# Altium schematic sheet 1A18J3_1A19J1 A.SchDoc: Cable Assembly
size A; Date: 1/1/17; CompanyName: National Center for Atmospheric Research; DrawnBy: Rich Erickson; Engineer: 4/21/17; Organization: Earth Observing Laboratory; Address1: 3450 Mitchell Lane; Address2: FL1; Address3: 3090 Center Green Dr.; Address4: Boulder, CO. 80301; DocumentNumber: 1A18J3_1A19J1(AC PWR, 120V); Revision: A; SheetNumber: 1; SheetTotal: 1; Department: Remote Sensing Facility; ModifiedDate: 7/17/97; ImagePath: 4/21/17; ProjectName: Ka Band; Application_BuildNumber: 5
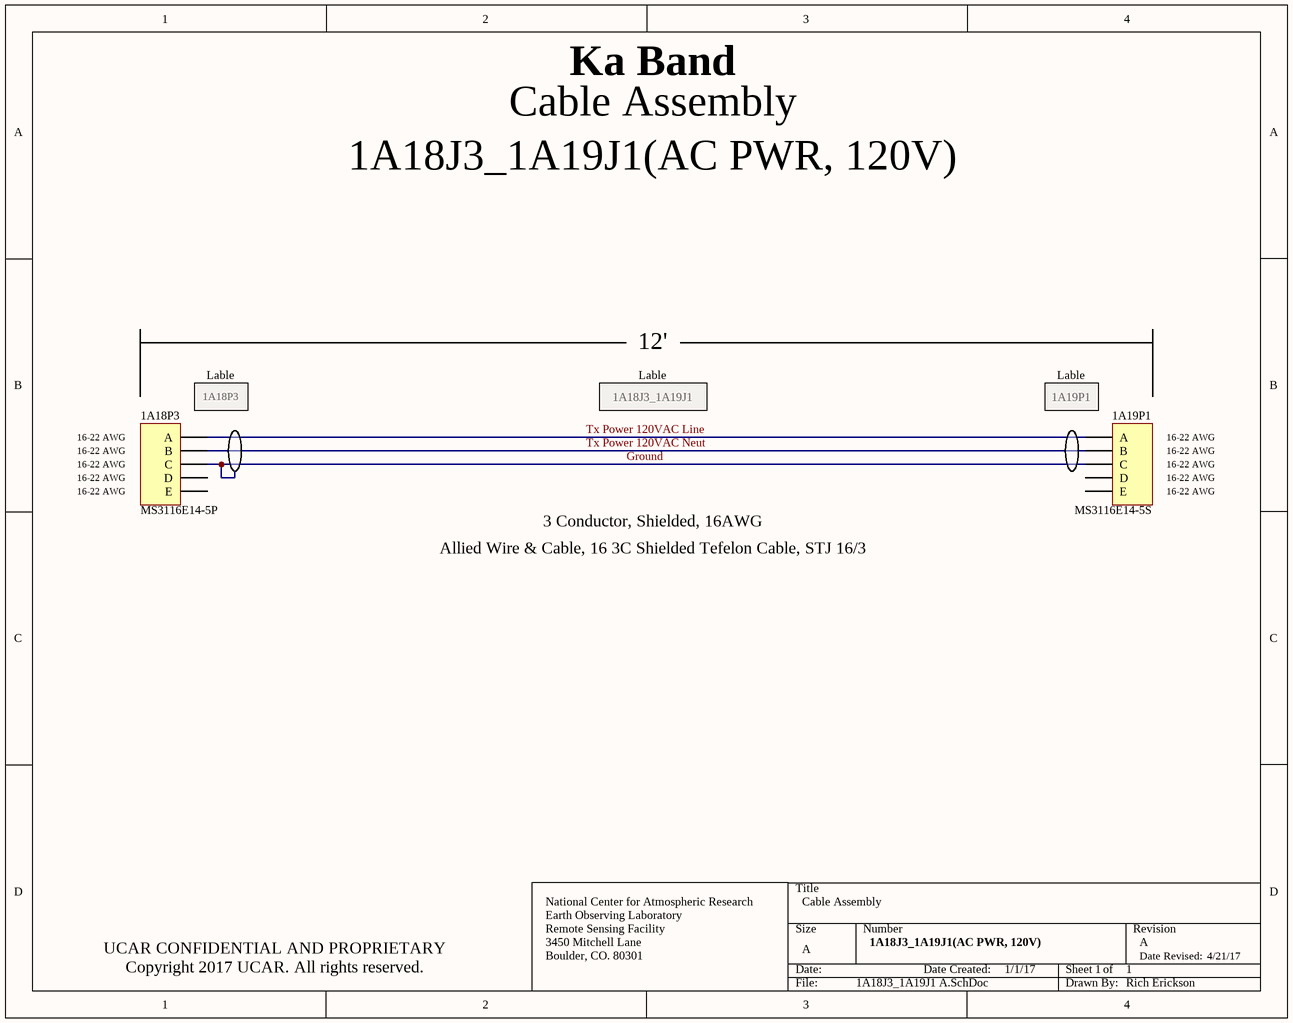
[diagram p0: 1A18J3_1A19J1 A.SchDoc]

## Parts
1A18P3  MS3116E14-5P  [HDR1X5]
1A19P1  MS3116E14-5S  [HDR1X5]

## Nets
Ground: 1A18P3.3(C) 1A19P1.3(C)
Tx Power 120VAC Line: 1A18P3.1(A) 1A19P1.1(A)
Tx Power 120VAC Neut: 1A18P3.2(B) 1A19P1.2(B)

Not connected (* = marked no-connect by the designer): 1A18P3 4(D) 5(E); 1A19P1 4(D) 5(E)

## Notes on the sheet
- 12'
- 16-22 AWG
- (near 1A18P3) 1A18P3
- Lable
- 1A18J3_1A19J1
- (near 1A19P1) 1A19P1
- 3 Conductor, Shielded, 16AWG
- Allied Wire & Cable, 16 3C Shielded Tefelon Cable, STJ 16/3
- UCAR CONFIDENTIAL AND PROPRIETARY
  Copyright 2017 UCAR. All rights reserved.
- Date Created:
- Date Revised:

## Library data of the parts
1A18P3 1A19P1 = Header 5: Header, 5-Pin; LatestRevisionDate: 17-Jul-2002; LatestRevisionNote: Re-released for DXP Platform.; Publisher: Altium Limited